# Altium schematic sheet Power.SchDoc
size A4; CompanyName: Technische Hochschule Nürnberg Georg Simon Ohm; Organization: UltraZohm; Address1: Kesslerplatz 12; Address2: 90489 Nürnberg; Address3: GERMANY; DocumentNumber: 3; SheetNumber: 3; SheetTotal: 5; Website: www.ultrazohm.com
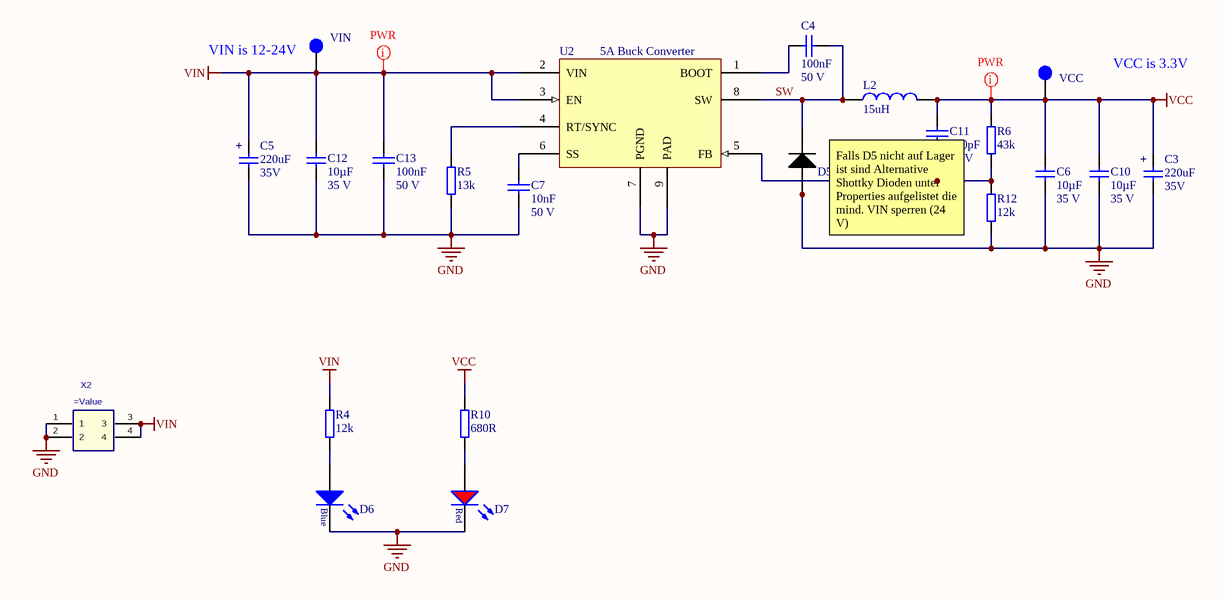
[diagram p0: Power.SchDoc]

## Parts
C3  220uF  Voltage: 35V  [CAPAE9083X105M]
C4  Rated Voltage: 50 V  [C_0603(1608)100_L]  (hidden comment: 100nF)
C5  220uF  Voltage: 35V  [CAPAE9083X105M]
C6  10µF  Voltage: 35 V  [C_1206]
C7  Rated Voltage: 50 V  [C_0603(1608)100_L]  (hidden comment: 10nF)
C10  10µF  Voltage: 35 V  [C_1206]
C11  Rated Voltage: 50 V  [C_0603(1608)100_L]  (hidden comment: 220pF)
C12  10µF  Voltage: 35 V  [C_1206]
C13  Rated Voltage: 50 V  [C_0603(1608)100_L]  (hidden comment: 100nF)
D5  (no value)  [DPAK254P1542X460-3N]
D6  150060BS75000  [WL-SMCW_0603]  (value not drawn)
D7  150060RS75000  [WL-SMCW_0603]  (value not drawn)
L2  15uH  [MWSA1004]
R4  12k  [R_0603_N]
R5  13k  [R_0603_N]
R6  43k  [R_0603_N]
R10  680R  [R_0603_N]
R12  12k  [R_0603_N]
U2  5A Buck Converter  [SOP127P600X170_HS-9N]
VCC  Testpoint 1mm  [TP_1mm]  (value not drawn)  (no BOM)
VIN  Testpoint 1mm  [TP_1mm]  (value not drawn)  (no BOM)
X2  (no value)  [IPL1-102-01-L-D-K]

## Nets
GND: C3.2 C5.2 C6.1 C7.2 C10.1 C12.1 C13.1 D5.1(A) D5.3(A) D6.1(K) D7.1(K) R5.1 R12.1 U2.7(PGND) U2.9(PAD) X2.1 X2.2
VCC: C3.1 C6.2 C10.2 C11.1 L2.2 R6.2 R10.2 VCC.1
VIN: C5.1 C12.2 C13.2 R4.2 U2.2(VIN) U2.3(EN) VIN.1 X2.3 X2.4
SW: C4.2 D5.4(K) L2.1 U2.8(SW)
NetC4_1: C4.1 U2.1(BOOT)
NetC7_1: C7.1 U2.6(SS)
NetC11_2: C11.2 R6.1 R12.2 U2.5(FB)
NetD6_2: D6.2(A) R4.1
NetD7_2: D7.2(A) R10.1
NetR5_2: R5.2 U2.4(RT/SYNC)

## Layout directives
mark named PWR: VCC, VIN

## Notes on the sheet
- (near VIN) VIN is 12-24V
- VCC is 3.3V
- (near C11) Falls D5 nicht auf Lager ist sind Alternative Shottky Dioden unter Properties aufgelistet die mind. VIN sperren (24 V)
- Title
- Revision:
- Design Engineer:
- Date:
- Project:
- Sheet
- of
- (in symbol C_ELKO_8x10) +

## Library data of the parts
C3 C5 = C_ELKO_8x10: ALUMINUM ELECTROLYTIC CAPACITOR; MPN: tbd; Tolerance: 20%; Package: 8x10; Value: 220uF; Created: 2018_06_25_AGeiger; Supplier Part Number 1: tbd; LCSC Part #: C311611; Dielectric: tbd; Supplier 1: tbd
C4 C7 C11 C13 = C_0603: CAP 0603 (1608 Metric) SMD; Tolerance: ±5%; Case-Metric: 1608; Case-EIA: 0603; Max Thickness: 1 mm; Technology: SMT; Created: 2018_09_06_AGeiger; Dielectric: *; Supplier 1: *; Supplier Part Number 1: *; MF: *; MPN: *; Package: 0603
  C4 C13: LCSC Part #: C14663; Value: 100nF
  C7: LCSC Part #: C57112; Value: 10nF
  C11: LCSC Part #: C1603; Value: 220pF
C6 C10 C12 = C_1206: Capacitor 1206; MPN: GMK316BJ106KL-T; Tolerance: 10%; MF: Taiyo Yuden; Dielectric: X5R; Package: 1206; Value: 10µF; Created: 2018_06_25_AGeiger; Supplier 1: Mouser; Supplier Part Number 1: 963-GMK316BJ106KL-T; LCSC Part #: C13585
D5 = STPS30L60CG-TR: SCHOTTKY BARRIER DIODES (SBD) TO-263-2 ROHS; ComponentLink1Description: Manufacturer; ComponentLink1URL: STMicroelectronics; ComponentLink2Description: Datasheet; LCSC Part # 4: C213442; LCSC Part # 2: C172486; LCSC Part # 3: C180216; LCSC Part #: C181026
D6 = LED_Blue_0603: WL-SMCW SMD Mono-color Chip LED Waterclear, size 0603, Blue, 3.2 V, 140°; Forward Voltage: 3.2 V; Luminous Intensity: 145 mcd; Peak Wavelength: 465 nm; Dominant Wavelength: 470 nm; MF: Wuerth Elektronik; Published Date: Sep. 2017; ComponentLink1Description: Manufacturer; ComponentLink1URL: http://www.we-online.de; ComponentLink2Description: Datasheet; ComponentLink2URL: http://katalog.we-online.com/led/datasheet/150060BS75000.pdf; MPN: 150060BS75000; Size: 0603; Viewing Angle: 140°; Emitting Color: Blue; Value: 150060BS75000; Package: 0603; Created: 2018_09_06_AGeiger; Supplier 1: Farnell; Supplier Part Number 1: 2322069; Supplier 2: Mouser; Supplier Part Number 2: 710-150060BS75000; Supplier 3: Digi-Key; Supplier Part Number 3: 732-4966-1-ND; LCSC Part #: C72041
D7 = LED_Red_0603: WL-SMCW SMD Mono-color Chip LED Waterclear, size 0603, Red, 2 V, 140°; Forward Voltage: 2 V; Luminous Intensity: 250 mcd; Peak Wavelength: 630 nm; Dominant Wavelength: 625 nm; MF: Wuerth Elektronik; Published Date: Sep. 2017; ComponentLink1Description: Manufacturer; ComponentLink1URL: http://www.we-online.de; ComponentLink2Description: Datasheet; ComponentLink2URL: http://katalog.we-online.com/led/datasheet/150060RS75000.pdf; MPN: 150060RS75000; Size: 0603; Viewing Angle: 140°; Emitting Color: Red; Value: 150060RS75000; Package: 0603; Created: 2018_09_06_AGeiger; Supplier 1: Farnell; Supplier Part Number 1: 2322071; Supplier 2: Mouser; Supplier Part Number 2: 710-150060RS75000; Supplier 3: Digi-Key; Supplier Part Number 3: 732-4978-1-ND; LCSC Part #: C2286
L2 = Inductor_2.2uH_13A: POWER INDUCTORS 2.2UH ±20% 13A SMD,10.5X11.5X4.0MM ROHS; Current rated: 6.25A; Value2: 2.2uH; LCSC Part2 #: C149550; Current rated2: 13A; LCSC Part #: C151872; Value: 15uH
R4-R6 R12 = R_0603_JLC: SMD Resistor 0603; Tolerance: 1%; Voltage: 50V; Power: 100 mW; Package: 0603; Created: 2018_09_06_AGeiger; Supplier 1: *; Supplier Part Number 1: *
  R4 R12: Value: 12k; LCSC Part #: C22790
  R5: Value: 13k; LCSC Part #: C22797
  R6: Value: 43k; LCSC Part #: C23172
R10 = R_0603: SMD Resistor 0603; MPN: CR0603-FX-3901ELF; Tolerance: 1%; Voltage: 75V; Power: 100 mW; MF: Bourns; Package: 0603; Value: 680R; Created: 2018_09_06_AGeiger; Supplier 1: Mouser; Supplier Part Number 1: 652-CR0603-FX3901ELF; LCSC Part #: C23228
U2 = LMR14050: SIMPLE SWITCHER® 40-V, 5-A, 2.2-MHz step-down converter with 40-μA IQr; MPN: LMR14050SDDAR; MF: Texas Instruments; fSW: 1 MHz; Created: 2020_04_Kreppel; Package: HSOIC-8; Supplier 1: Mouser; Supplier Part Number 1: 595-LMR14050SDDAR; LCSC Part #: C155484
VCC VIN = TP_1mm: Created: 2018_06_25_AGeiger; Value: Testpoint 1mm
X2 = IPL1-102-XX-X-D-X: 2.54mm Double Row Terminal Assembly, Right-Angled; Manufacturer: SAMTEC; Created: 2018_05_02_AGeiger; Value: =MPN; MPN: IPL1-102-01-L-D-K